# EAGLE schematic Williams Avalanche Pulser (EAGLE 6.5.0)
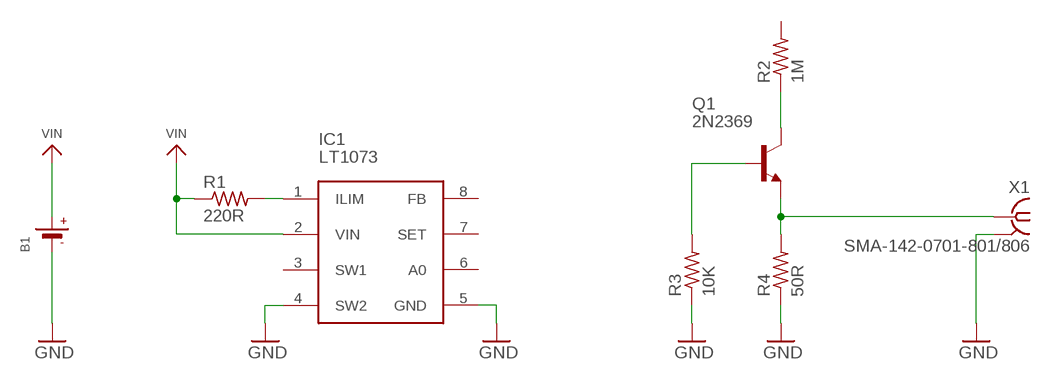
[diagram p0: schematic, sheet 1]

## Parts
B1  BATTERYCR1220_SMT  [CR1220]
IC1  LT1073  [SOIC8]
Q1  2N2369  [TO18]
R1  220R  R-US_R0805  [R0805]
R2  1M  R-US_R0805  [R0805]
R3  10K  R-US_R0805  [R0805]
R4  50R  R-US_R0805  [R0805]
X1  SMA-142-0701-801/806  [J502-ND-142-0701-801/806]

## Nets
GND: B1.- IC1.4(SW2) IC1.5(GND) R3.1 R4.1 X1.G@1 X1.G@2 X1.G@3 X1.G@4
N$1: IC1.1(ILIM) R1.2
N$2: Q1.1(E) R4.2 X1.1
N$3: Q1.2(B) R3.2
N$4: Q1.3(C) R2.1
VIN: B1.+$1(+) IC1.2(VIN) R1.1
Unconnected: IC1.3(SW1) IC1.6(A0) IC1.7(SET) IC1.8(FB) R2.2

## Library data of the parts
B1 = microbuilder:BATTERY: CR1220 SMT - Digikey: 3001K-ND
IC1 = Kramnik's Library:LT1073
Q1 = transistor-npn:2N2369*: NPN Transistor
R1-R4 = rcl:R-US_: RESISTOR, American symbol
X1 = con-coax:SMA-: SMA 50 Ohm End Launch Jack Receptacle - Round Contact Johnson Components Source: www.johnsoncomponents.com .. J502-ND.pdf; MF: JOHNSON COMPONENTS; MPN: 142-0701-801; OC_FARNELL: 1608592; OC_NEWARK: 90F2624